# Altium schematic sheet EEPROM programmer.SchDoc
size A4
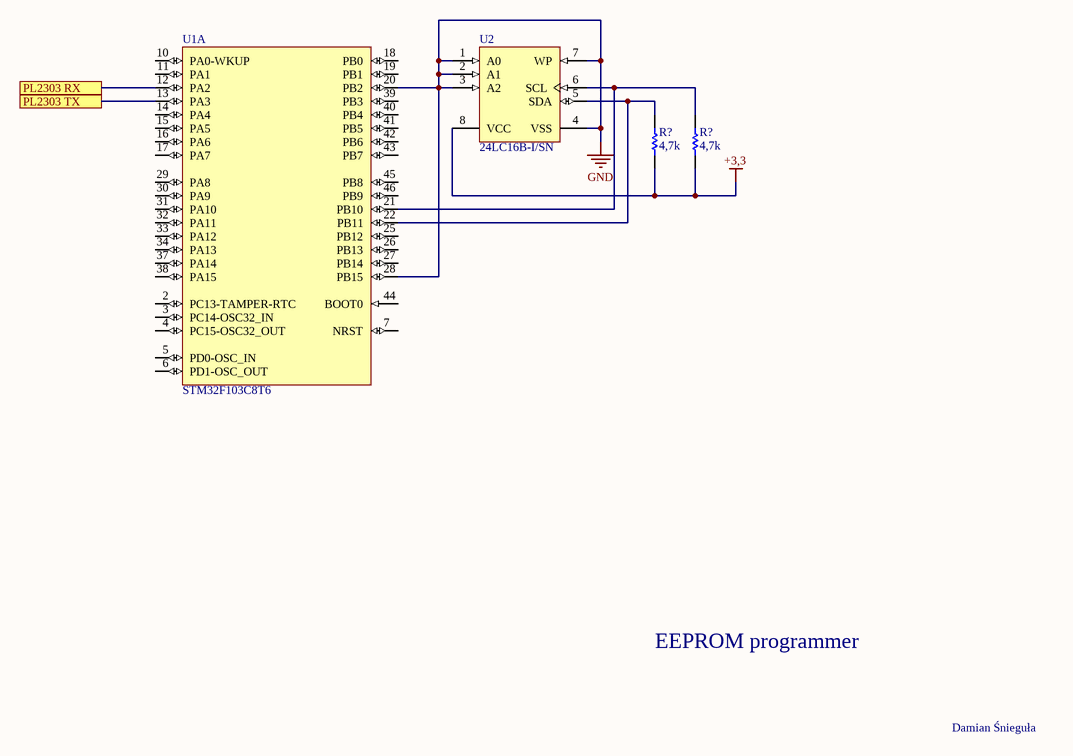
[diagram p0: EEPROM programmer.SchDoc]

## Parts
(Parts that share a designator on the sheet are numbered #1, #2 ... from top to bottom, then left to right.)
R?#1  4,7k  [RESC1608X55X30NL20T20]
R?#2  4,7k  [RESC1608X55X30NL20T20]
U1  STM32F103C8T6  [STM-LQFP48_L]  (part A of 2)
U2  24LC16B-I/SN  [SOIC-SN8_M]

## Ports
PL2303 RX, PL2303 TX

## Nets
+3,3: R?#1.1 R?#2.1 U2.8(VCC)
GND: U1.20(PB2) U1.28(PB15) U2.1(A0) U2.2(A1) U2.3(A2) U2.4(VSS) U2.7(WP)
PL2303 RX: U1.12(PA2) ; port PL2303 RX
PL2303 TX: U1.13(PA3) ; port PL2303 TX
NetR?#1_2: R?#1.2 U1.22(PB11) U2.5(SDA)
NetR?#2_2: R?#2.2 U1.21(PB10) U2.6(SCL)

Not connected (* = marked no-connect by the designer): U1 2(PC13-TAMPER-RTC) 3(PC14-OSC32_IN) 4(PC15-OSC32_OUT) 5(PD0-OSC_IN) 6(PD1-OSC_OUT) 7(NRST) 10(PA0-WKUP) 11(PA1) 14(PA4) 15(PA5) 16(PA6) 17(PA7) 18(PB0) 19(PB1) 25(PB12) 26(PB13) 27(PB14) 29(PA8) 30(PA9) 31(PA10) 32(PA11) 33(PA12) 34(PA13) 37(PA14) 38(PA15) 39(PB3) 40(PB4) 41(PB5) 42(PB6) 43(PB7) 44(BOOT0) 45(PB8) 46(PB9)

## Notes on the sheet
- EEPROM programmer
- Damian Śnieguła

## Library data of the parts
R?#1 R?#2 = CMP-2000-00882-1: Manufacturer: Panasonic; Part Number: ERA3AEB112V
U1 = CMP-0237-00215-3: ARM Cortex-M3 32-bit MCU, 64 KB Flash, 20 KB Internal RAM, 37 I/Os, 48-pin LQFP, -40 to 85 degC, Tray; Supply Voltage(Vcc) min (V): 2; Internal RAM Size (kB): 20; FLASH Size (Prog) (kB): 64; A/D Converter: 2x12-bit (10 Channel); I/Os (High Current): 37; Operating Frequency(F) (Processor speed) (MHz): 72; Core: ARM Cortex-M3; ComponentLink3Description: Package Specification; Mounting Technology: Surface Mount; PartNumber: STM32F103C8T6; PackageReference: LQFP48; Packing: Tray; ComponentLink3URL: http://www.st.com/st-web-ui/static/active/en/resource/technical/document/datasheet/DM00058181.pdf; DatasheetVersion: Rev. 16; ComponentLink1URL: http://www.st.com/web/en/home.html; PackageVersion: Rev. 6, 06/2013; ComponentLink2URL: http://www.st.com/st-web-ui/static/active/en/resource/technical/document/datasheet/CD00161566.pdf; ComponentLink1Description: Manufacturer URL; ComponentLink2Description: Datasheet; PackageDescription: 48-Pin Low Profile Quad Flat Package, 7 x 7 mm Body, 0.5 mm Pitch
U2 = CMP-0159-00214-1: 16Kbit, 400kHz, 2.5V, I2C Serial EEPROM, 8-Pin SOIC 150mil, Industrial Temperature; PackageReference: SOIC-SN8; PackageDescription: 8-Lead Plastic Small Outline (SN) - Narrow, 3.90mm Body [SOIC]; Code_JEDEC: MS-012; Code_IPC: SOIC127P600-8; DatasheetVersion: revJ, Oct-2009; PackageVersion: revBB, Aug-2009